# Altium project RcMPPT.PrjPcb
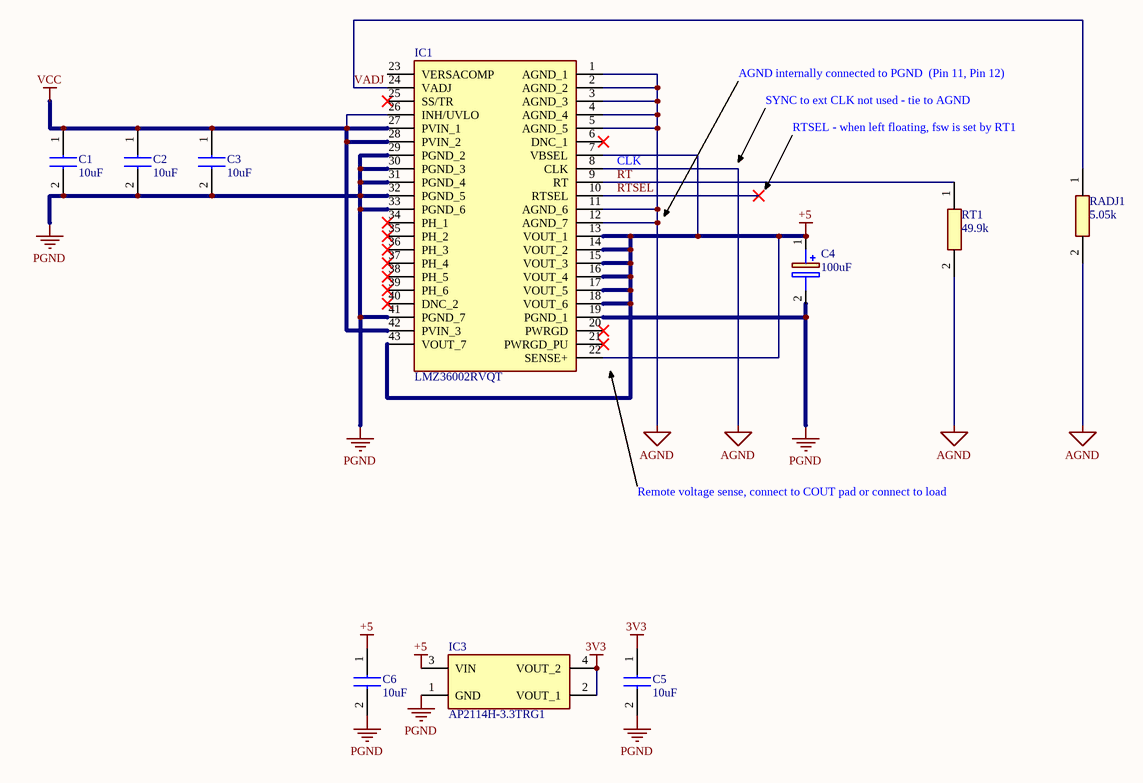
[diagram p0: RcMPPT-Power_Module.SchDoc]
1 sheet, 10 parts. Net scope: global (net labels, ports and power ports of the same name join across sheets).
Board file: RcMPPT-SCC.PcbDoc

## Sheet RcMPPT-Power_Module.SchDoc: RcMPPT-Power_Module
size A4; Author: Thomas Hofmann; DocumentNumber: 1; Revision: 1.0; SheetNumber: 1; SheetTotal: 2

### Parts
C1  10uF  [CAPC3225X280N]
C2  10uF  [CAPC3225X280N]
C3  10uF  [CAPC3225X280N]
C4  100uF  [CAPPM3528X200N]
C5  10uF  [CAPC3225X280N]
C6  10uF  [CAPC3225X280N]
IC1  LMZ36002RVQT  [LMZ36002RVQR]
IC3  AP2114H-3.3TRG1  [SOT230P700X180-4N]
RADJ1  5.05k  [R0805]
RT1  49.9k  [R0805]

### Nets
3V3: C5.1 IC3.2(VOUT_1) IC3.4(VOUT_2)
+5: C4.1(+) C6.1 IC1.7(VBSEL) IC1.13(VOUT_1) IC1.14(VOUT_2) IC1.15(VOUT_3) IC1.16(VOUT_4) IC1.17(VOUT_5) IC1.18(VOUT_6) IC1.22(SENSE+) IC1.43(VOUT_7) IC3.3(VIN)
AGND: IC1.1(AGND_1) IC1.2(AGND_2) IC1.3(AGND_3) IC1.4(AGND_4) IC1.5(AGND_5) IC1.8(CLK) IC1.11(AGND_6) IC1.12(AGND_7) RADJ1.2 RT1.2
PGND: C1.2 C2.2 C3.2 C4.2(-) C5.2 C6.2 IC1.19(PGND_1) IC1.29(PGND_2) IC1.30(PGND_3) IC1.31(PGND_4) IC1.32(PGND_5) IC1.33(PGND_6) IC1.41(PGND_7) IC3.1(GND)
VCC: C1.1 C2.1 C3.1 IC1.26(INH/UVLO) IC1.27(PVIN_1) IC1.28(PVIN_2) IC1.42(PVIN_3)
RT: IC1.9(RT) RT1.1
RTSEL: IC1.10(RTSEL)
VADJ: IC1.24(VADJ) RADJ1.1

Not connected (* = marked no-connect by the designer): IC1 6(DNC_1)* 20(PWRGD)* 21(PWRGD_PU)* 23(VERSACOMP) 25(SS/TR)* 34(PH_1)* 35(PH_2)* 36(PH_3)* 37(PH_4)* 38(PH_5)* 39(PH_6)* 40(DNC_2)*

### Notes on the sheet
- AGND internally connected to PGND  (Pin 11, Pin 12)
- (near IC1) CLK
- SYNC to ext CLK not used - tie to AGND
- RTSEL - when left floating, fsw is set by RT1
- Remote voltage sense, connect to COUT pad or connect to load
- Title
- Size:
- Date:
- A4
- Number:
- Time:
- Revision:
- Sheet
- of
- File:

### Library data of the parts
C1-C3 C5 C6 = CL32B106KMVNNWE: Capacitor; Manufacturer_Name: Samsung Electro-Mechanics; Datasheet Link: https://www.arrow.com/en/products/cl32b106kmvnnwe/samsung-electro-mechanics; Height: 2.8mm; Manufacturer_Part_Number: CL32B106KMVNNWE; Arrow Part Number: CL32B106KMVNNWE; Arrow Price/Stock: https://www.arrow.com/en/products/cl32b106kmvnnwe/samsung-electro-mechanics; Mouser Part Number: N/A; Mouser Price/Stock: https://www.mouser.co.uk/ProductDetail/Samsung-Electro-Mechanics/CL32B106KMVNNWE?qs=xZ%2FP%252Ba9zWqaEMBbSgKy8gQ%3D%3D
C4 = 8TPE100MAZB: Capacitor Polarised; Manufacturer_Name: Panasonic; Datasheet Link: http://uk.rs-online.com/web/p/products/7887374; Height: 2mm; Manufacturer_Part_Number: 8TPE100MAZB; Arrow Part Number: 8TPE100MAZB; Arrow Price/Stock: https://www.arrow.com/en/products/8tpe100mazb/panasonic; Mouser Part Number: 667-8TPE100MAZB; Mouser Price/Stock: https://www.mouser.co.uk/ProductDetail/Panasonic/8TPE100MAZB?qs=OE1iw1LrrPHKTwwfsidxgA%3D%3D
IC1 = LMZ36002RVQT: Integrated Circuit; Manufacturer_Name: Texas Instruments; Datasheet Link: http://www.ti.com/lit/gpn/lmz36002; Height: 2.13mm; Manufacturer_Part_Number: LMZ36002RVQT; Arrow Part Number: LMZ36002RVQT; Arrow Price/Stock: https://www.arrow.com/en/products/lmz36002rvqt/texas-instruments; Mouser Part Number: 595-LMZ36002RVQT; Mouser Price/Stock: https://www.mouser.co.uk/ProductDetail/Texas-Instruments/LMZ36002RVQT?qs=kFLL9AfgRSBjXTxBMSjGOw%3D%3D
IC3 = AP2114H-3.3TRG1: Integrated Circuit; Manufacturer_Name: Diodes Inc.; Datasheet Link: http://uk.rs-online.com/web/p/products/8283528; Height: 1.8mm; Manufacturer_Part_Number: AP2114H-3.3TRG1; Arrow Part Number: AP2114H-3.3TRG1; Arrow Price/Stock: https://www.arrow.com/en/products/ap2114h-3.3trg1/diodes-incorporated; Mouser Part Number: 621-AP2114H-3.3TRG1; Mouser Price/Stock: https://www.mouser.co.uk/ProductDetail/Diodes-Incorporated/AP2114H-33TRG1?qs=x6A8l6qLYDDSG%2FfwzcsOhw%3D%3D
RADJ1 = RT0805BRD075K05L: Resistor; Manufacturer_Name: Yageo; Datasheet Link: https://www.mouser.at/datasheet/2/447/PYu-RT_1-to-0.01_RoHS_L_11-1669912.pdf; Height: 0.7mm; Manufacturer_Part_Number: RT0805BRD075K05L; Mouser Part Number: 603-RT0805BRD075K05L; Mouser Price/Stock: https://www.mouser.at/ProductDetail/Yageo/RT0805BRD075K05L?qs=bQfrgN9vNvwObDVrZ%2FDM5w%3D%3D
RT1 = ERJ-6ENF4992V: Resistor; Manufacturer_Name: Panasonic; Datasheet Link: https://industrial.panasonic.com/cdbs/www-data/pdf/RDA0000/AOA0000C84.pdf; Height: 0.7mm; Manufacturer_Part_Number: ERJ-6ENF4992V; Mouser Part Number: 667-ERJ-6ENF4992V; Mouser Price/Stock: https://www.mouser.com/Search/Refine.aspx?Keyword=667-ERJ-6ENF4992V